# Altium schematic sheet programm socket.SchDoc
size A4
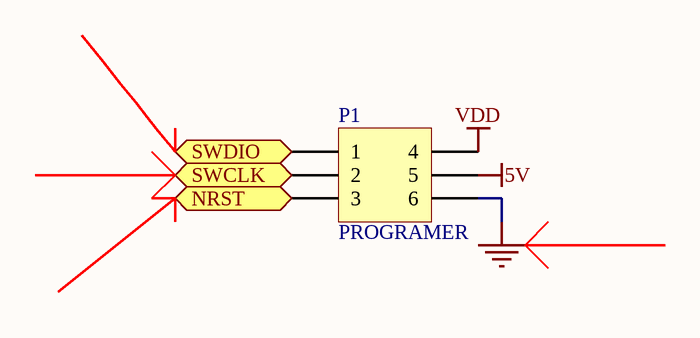
[diagram p0: programm socket.SchDoc]

## Parts
P1  PROGRAMER  [HDR2X3_CEN]

## Ports
NRST, SWCLK, SWDIO

## Nets
5V: P1.5
GND: P1.6
VDD: P1.4
NRST: P1.3 ; port NRST
SWCLK: P1.2 ; port SWCLK
SWDIO: P1.1 ; port SWDIO

## Library data of the parts
P1 = Header 3X2A: Header, 3-Pin, Dual row; LatestRevisionDate: 17-Jul-2002; LatestRevisionNote: Re-released for DXP Platform.; Publisher: Altium Limited